# EAGLE design suzie_bot (EAGLE 7.6.0)
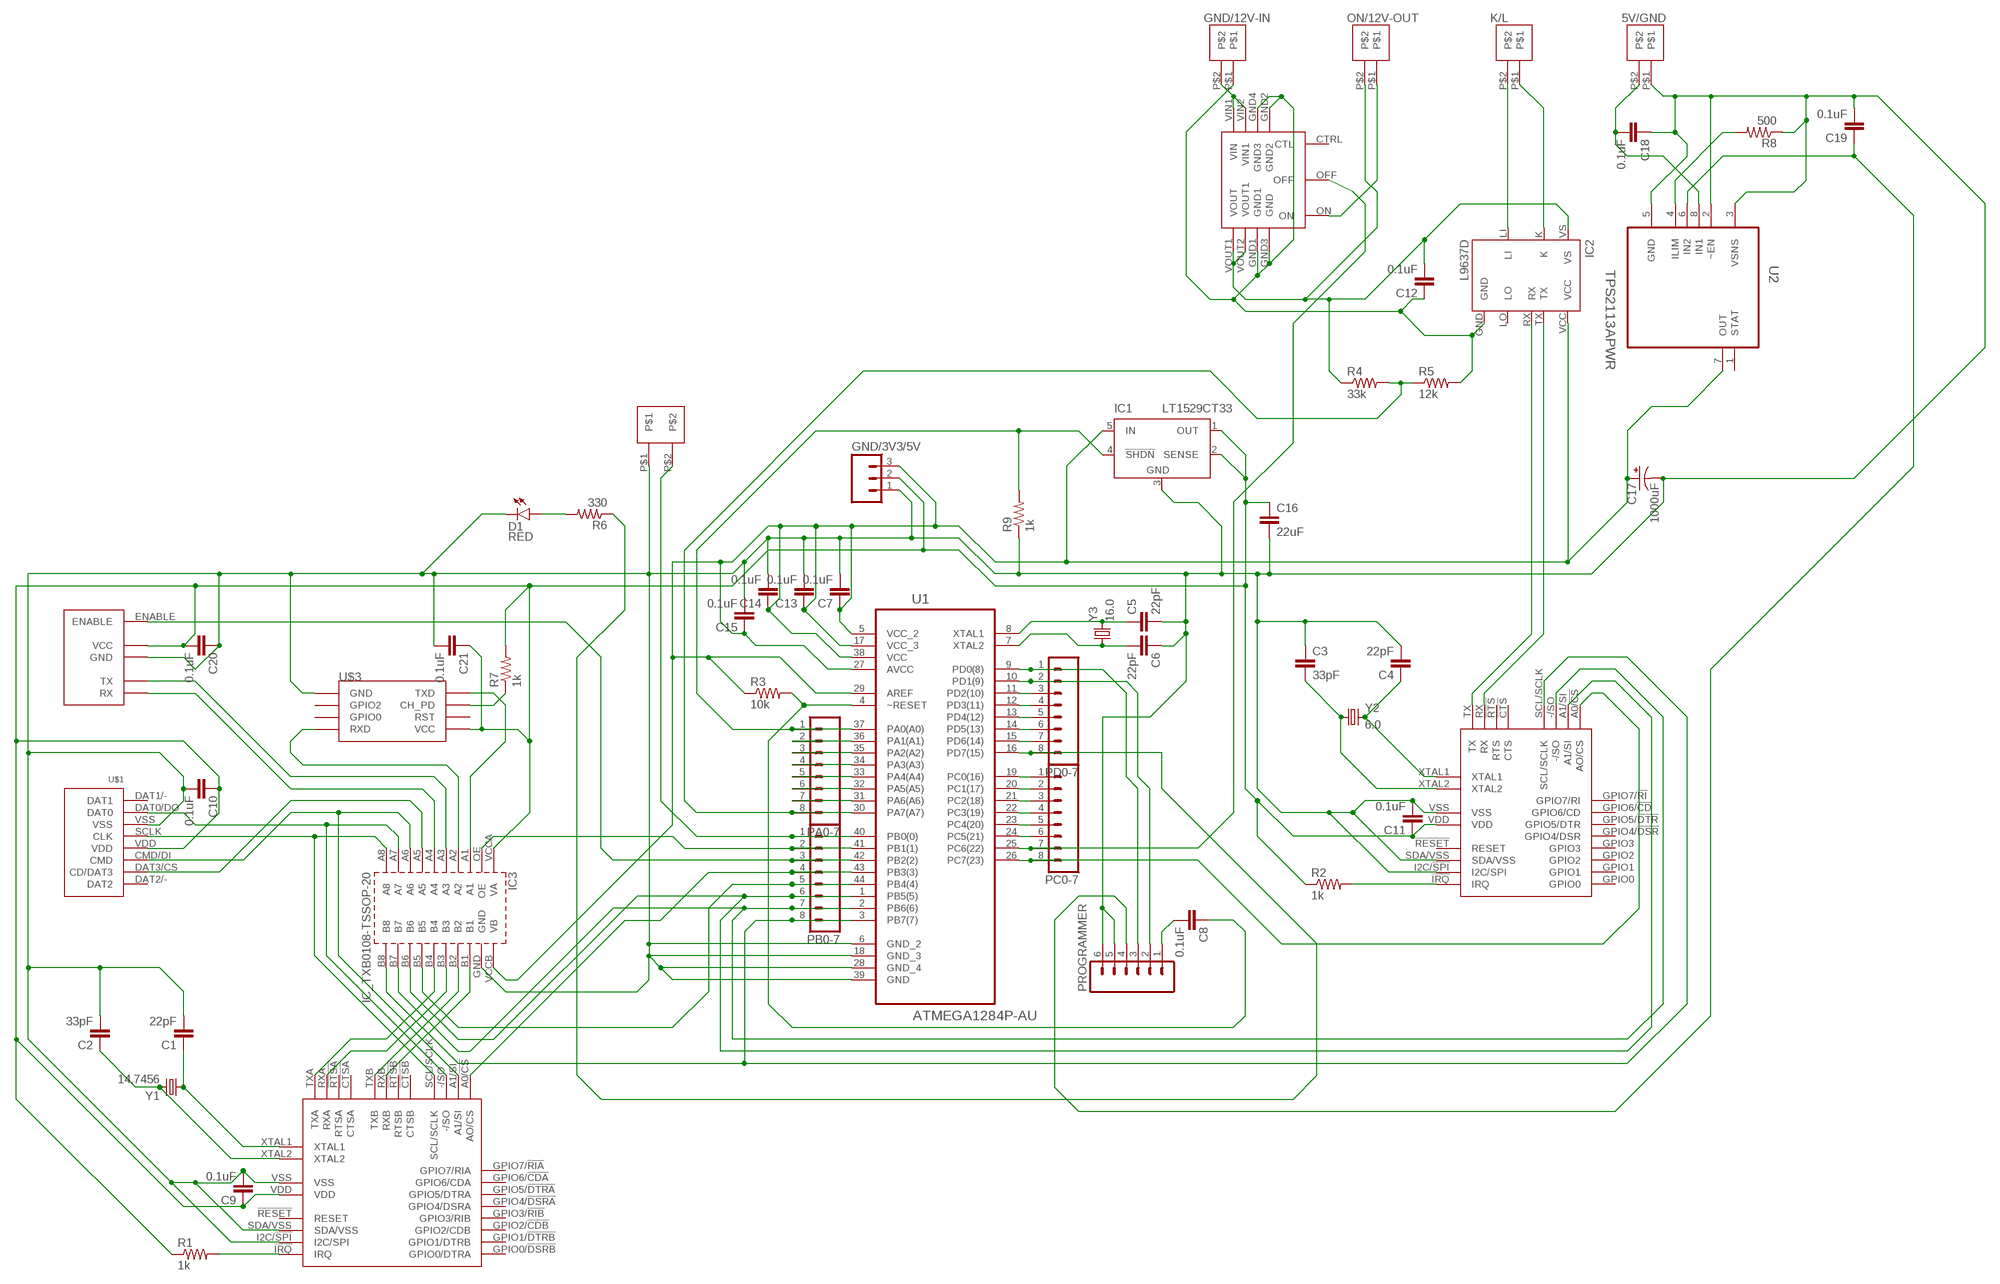
[diagram p0: schematic, sheet 1]

## Parts
5V/GND  2-PIN-TERMINAL  [2-PIN-TERMINAL]
C1  22pF  CAP0805  [0805]
C2  33pF  CAP0805  [0805]
C3  33pF  CAP0805  [0805]
C4  22pF  CAP0805  [0805]
C5  22pF  CAP0805  [0805]
C6  22pF  CAP0805  [0805]
C7  0.1uF  CAP0603-CAP  [0603-CAP]
C8  0.1uF  CAP0805  [0805]
C9  0.1uF  CAP0603-CAP  [0603-CAP]
C10  0.1uF  CAP0603-CAP  [0603-CAP]
C11  0.1uF  CAP0603-CAP  [0603-CAP]
C12  0.1uF  CAP0603-CAP  [0603-CAP]
C13  0.1uF  CAP0603-CAP  [0603-CAP]
C14  0.1uF  CAP0603-CAP  [0603-CAP]
C15  0.1uF  CAP0603-CAP  [0603-CAP]
C16  22uF  CAP1206  [1206]
C17  1000uF  CPOL-USG  [PANASONIC_G]
C18  0.1uF  CAP0603-CAP  [0603-CAP]
C19  0.1uF  CAP0603-CAP  [0603-CAP]
C20  0.1uF  CAP0603-CAP  [0603-CAP]
C21  0.1uF  CAP0603-CAP  [0603-CAP]
D1  RED  LED5MM  [LED5MM]
GND/3V3/5V  M03PTH  [1X03]
GND/12V-IN  2-PIN-TERMINAL  [2-PIN-TERMINAL]
IC1  LT1529CT33  LT1529T  [TO220-5]
IC2  L9637D  [SO08]
IC3  IC_TXB0108-TSSOP-20  [TSSOP-20]
K/L  2-PIN-TERMINAL  [2-PIN-TERMINAL]
ON/12V-OUT  2-PIN-TERMINAL  [2-PIN-TERMINAL]
PA0-7  M08  [1X08_ROUND]
PB0-7  M08  [1X08_ROUND]
PC0-7  M08  [1X08_ROUND]
PD0-7  M08  [1X08_ROUND]
PROGRAMMER  M06SILK_FEMALE_PTH  [1X06]
R1  1k  RESISTOR0805-RES  [0805]
R2  1k  RESISTOR0805-RES  [0805]
R3  10k  RESISTOR0805-RES  [0805]
R4  33k  RESISTOR0805-RES  [0805]
R5  12k  RESISTOR0805-RES  [0805]
R6  330  RESISTOR0805-RES  [0805]
R7  1k  RESISTOR0805-RES  [0805]
R8  500  RESISTOR0805-RES  [0805]
R9  1k  RESISTOR0805-RES  [0805]
U1  ATMEGA1284P-AU  [QFP80P1200X1200X120-44N]
U2  TPS2113APWR  [SOP65P640X120-8N]
U$1  CON_MICROSDHINGED  [CON_MICROSD_HINGED]
U$2  SC16IS752IPW  [TSSOP28]
U$3  ESP01  [ESP01]
U$4  MINI  [MINI]
U$5  FEATHERWING  [FEATHERWING]
U$7  SC16IS750IPW  [TSSOP-24]
U$11  PIEZO  [17MM-PIEZO]
Y1  14.7456  CRYSTALHC49US  [HC49US]
Y2  6.0  CRYSTALHC49US  [HC49US]
Y3  16.0  CRYSTALHC49US  [HC49US]

## Nets
3V3 [power]: C9.1 C10.1 C11.1 C16.1 C20.2 C21.1 GND/3V3/5V.2 IC1.1(OUT) IC1.2(SENSE) IC3.VCCA(VA) R1.1 R2.1 R7.2 U$1.VDD U$2.VDD U$3.VCC U$5.VCC U$7.VDD
5V [power]: C7.1 C13.1 C14.1 C15.1 C17.+ GND/3V3/5V.3 IC1.5(IN) IC2.VCC IC3.VCCB(VB) R3.1 U1.5(VCC_2) U1.17(VCC_3) U1.27(AVCC) U1.29(AREF) U1.38(VCC) U2.7(OUT)
12V-OUT [power]: C12.2 IC2.VS ON/12V-OUT.P$2 R4.1 U$4.VOUT1(VOUT) U$4.VOUT2(VOUT1)
EXTGND [power]: C12.1 GND/12V-IN.P$1 IC2.GND R5.2 U$4.GND1 U$4.GND2 U$4.GND3(GND) U$4.GND4(GND3)
GND [power]: 5V/GND.P$1 C1.2 C2.2 C3.1 C4.2 C5.2 C6.1 C7.2 C9.2 C10.2 C11.2 C13.2 C14.2 C15.2 C16.2 C17.- C18.1 C19.2 C20.1 C21.2 D1.K(C) GND/3V3/5V.1 IC1.3(GND) IC3.GND PROGRAMMER.5 PROGRAMMER.6 R8.1 R9.1 U1.6(GND_2) U1.18(GND_3) U1.28(GND_4) U1.39(GND) U2.2(~EN) U2.3(VSNS) U2.5(GND) U$1.VSS U$2.I2C/!SPI(I2C/SPI) U$2.SDA/VSS U$2.VSS U$3.GND U$5.GND U$7.I2C/!SPI(I2C/SPI) U$7.SDA/VSS U$7.VSS U$11.P$1
K [power]: IC2.K K/L.P$1
L [power]: IC2.LI K/L.P$2
MISO3V3: IC3.A7 U$1.DAT0/DO(DAT0) U$2.-/SO
MOSI3V3: IC3.A6 U$1.CMD/DI(CMD) U$2.A1/SI
N$1: C1.1 U$2.XTAL1 Y1.1
N$2: D1.A R6.2
N$3: C2.1 U$2.XTAL2 Y1.2
N$4: R7.1 U$3.CH_PD
N$5: IC3.A1 U$3.TX(TXD)
N$6: C6.2 U1.7(XTAL2) Y3.1
N$7: GND/12V-IN.P$2 U$4.VIN1(VIN) U$4.VIN2(VIN1)
N$8: IC3.A2 U$3.RX(RXD)
N$9: C5.1 U1.8(XTAL1) Y3.2
N$10: C8.2 PROGRAMMER.1
N$11: IC3.B1 U$2.RXB
N$12: IC3.B2 U$2.TXB
N$13: C8.1 R3.2 U1.4(~RESET)
N$14: IC3.A4 U$5.RX-2(RX)
N$15: IC2.RX U$7.TX
N$16: R2.2 U$7.!IRQ(IRQ)
N$17: IC3.B3 U$2.RXA
N$18: R1.2 U$2.!IRQ(IRQ)
N$19: IC2.TX U$7.RX
N$20: C4.1 U$7.XTAL1 Y2.2
N$21: C3.2 U$7.XTAL2 Y2.1
N$22: IC3.A3 U$5.TX-2(TX)
N$23: IC3.B4 U$2.TXA
N$24: IC3.A5 U$1.DAT3/CS(CD/DAT3)
N$25: IC3.OE PB0-7.2 U1.41(PB1(1))
N$26: IC3.B5 PB0-7.5 U1.44(PB4(4))
N$27: PA0-7.7 U1.31(PA6(A6))
N$28: PA0-7.6 U1.32(PA5(A5))
N$30: C19.1 PROGRAMMER.4 U2.6(IN2)
N$31: R8.2 U2.4(ILIM)
N$32: 5V/GND.P$2 C18.2 U2.8(IN1)
N$PD0/RXD0: PD0-7.1 PROGRAMMER.3 U1.9(PD0(8))
PA0: IC1.4(!SHDN) PA0-7.1 R9.2 U1.37(PA0(A0))
PA1: PA0-7.2 U1.36(PA1(A1))
PA2: PA0-7.3 U1.35(PA2(A2))
PA3: PA0-7.4 U1.34(PA3(A3))
PA4: PA0-7.5 U1.33(PA4(A4))
PA7: PA0-7.8 R4.2 R5.1 U1.30(PA7(A7))
PB0: PB0-7.1 U1.40(PB0(0)) U$11.P$2
PB2: PB0-7.3 U1.42(PB2(2)) U$5.ENABLE
PB3: PB0-7.4 U1.43(PB3(3)) U$2.A0/!CS(AO/CS)
PB5/MOSI: IC3.B6 PB0-7.6 U1.1(PB5(5)) U$7.A1/SI
PB6/MISO: IC3.B7 PB0-7.7 U1.2(PB6(6)) U$7.-/SO
PB7/SCLK: IC3.B8 PB0-7.8 U1.3(PB7(7)) U$7.SCL/SCLK
PC0: PC0-7.1 U1.19(PC0(16))
PC1: PC0-7.2 U1.20(PC1(17))
PC2: PC0-7.3 U1.21(PC2(18))
PC3: PC0-7.4 U1.22(PC3(19))
PC4: PC0-7.5 U1.23(PC4(20))
PC5: PC0-7.6 U1.24(PC5(21))
PC6: PC0-7.7 U1.25(PC6(22)) U$4.OFF
PC7: PC0-7.8 U1.26(PC7(23)) U$7.A0/!CS(AO/CS)
PD1/TXD0: PD0-7.2 PROGRAMMER.2 U1.10(PD1(9))
PD2/RXD1: PD0-7.3 U1.11(PD2(10))
PD3/TXD1: PD0-7.4 U1.12(PD3(11))
PD4: PD0-7.5 U1.13(PD4(12))
PD5: PD0-7.6 U1.14(PD5(13))
PD6: PD0-7.7 U1.15(PD6(14))
PD7: PD0-7.8 R6.1 U1.16(PD7(15))
POWERON [power]: ON/12V-OUT.P$1 U$4.ON
SKCK3V3: IC3.A8 U$1.SCLK(CLK) U$2.SCL/SCLK
Unconnected: IC2.LO U2.1(STAT) U$1.DAT1/-(DAT1) U$1.DAT2/-(DAT2) U$2.!CTSA(CTSA) U$2.!CTSB(CTSB) U$2.!RESET(RESET) U$2.!RTSA(RTSA) U$2.!RTSB(RTSB) U$2.GPIO0/!DSRB(GPIO0/DTRA) U$2.GPIO1/!DTRB(GPIO1/DTRB) U$2.GPIO2/!CDB(GPIO2/CDB) U$2.GPIO3/!RIB(GPIO3/RIB) U$2.GPIO4/!DSRA(GPIO4/DSRA) U$2.GPIO5/!DTRA(GPIO5/DTRA) U$2.GPIO6/!CDA(GPIO6/CDA) U$2.GPIO7/!RIA(GPIO7/RIA) U$3.GPIO0 U$3.GPIO2 U$3.RST U$4.CTRL(CTL) U$7.!CTS(CTS) U$7.!RESET(RESET) U$7.!RTS(RTS) U$7.GPIO0 U$7.GPIO1 U$7.GPIO2 U$7.GPIO3 U$7.GPIO4/!DSR(GPIO4/DSR) U$7.GPIO5/!DTR(GPIO5/DTR) U$7.GPIO6/!CD(GPIO6/CD) U$7.GPIO7/!RI(GPIO7/RI)

## Library data of the parts
5V/GND GND/12V-IN K/L ON/12V-OUT = randomjunk:2-PIN-TERMINAL
C1-C6 C8 = SparkFun-Passives:CAP: Capacitor Standard 0603 ceramic capacitor, and 0.1" leaded capacitor.
C7 C9-C16 C18-C21 = SparkFun-Capacitors:CAP: Capacitor Standard 0603 ceramic capacitor, and 0.1" leaded capacitor.
C17 = rcl:CPOL-US: POLARIZED CAPACITOR, American symbol
D1 = SparkFun-LED:LED: LEDs Standard schematic elements and footprints for 5mm, 3mm, 1206, and 0603 sized LEDs. 5mm - Spark Fun Electronics SKU : COM-00529 (and others)
GND/3V3/5V = SparkFun-Connectors:M03: Header 3 Standard 3-pin 0.1" header. Use with straight break away headers (SKU : PRT-00116), right angle break away headers (PRT-00553), swiss pins (PRT-00743), machine pins (PRT-00117), and female headers (PRT-00115). Molex polarized connector foot print use with SKU : PRT-08232 with associated crimp pins and housings.
IC1 = ltc1440_lt1529_ds1302:LT1529: LT1529 5 Volt LDO Regulator 5 Volt, 3 Ampere Low Dropout voltage regulator.
IC2 = st-microelectronics:L9637D: ISO 9141 INTERFACE Source: 1765.pdf
IC3 = dp_devices.v6:IC_TXB0108: 8-Bit bidirectional voltage level translator Mfr no: TXB0108PWR TXB0108PWR <http://www.digikey.com/product-detail/en/TXB0108PWR/296-21527-2-ND/1305699>
PA0-7 PB0-7 PC0-7 PD0-7 = SparkFun-Connectors:M08: Header 8 Standard 8-pin 0.1" header. Use with straight break away headers (SKU : PRT-00116), right angle break away headers (PRT-00553), swiss pins (PRT-00743), machine pins (PRT-00117), and female headers (PRT-00115).; PROD_ID: CONN-08437
PROGRAMMER = SparkFun-Connectors:M06: Header 6 Standard 6-pin 0.1" header. Use with straight break away headers (SKU : PRT-00116), right angle break away headers (PRT-00553), swiss pins (PRT-00743), machine pins (PRT-00117), and female headers (PRT-00115). Molex polarized connector foot print use with SKU : PRT-08094 with associated crimp pins and housings. NOTES ON THE VARIANTS LOCK and LOCK_LONGPADS... This footprint was designed to help hold the alignment of a through-hole component (i.e. 6-pin header) while soldering it into place. You may notice that each hole has been shifted either up or down by 0.005 of an inch from it's more standard position (which is a perfectly straight line). This slight alteration caused the pins (the squares in the middle) to touch the edges of the holes. Because they are alternating, it causes a "brace" to hold the component in place. 0.005 has proven to be the perfect amount of "off-center" position when using our standard breakaway headers. Although looks a little odd when you look at the bare footprint, once you have a header in there, the alteration is very hard to notice. Also,if you push a header all the way into place, it is covered up entirely on the bottom side. This idea of altering the position of holes to aid alignment will be further integrated into the Sparkfun Library for other footprints. It can help hold any component with 3 or more connection pins.; PROD_ID: CONN-08437
R1-R9 = SparkFun-Passives:RESISTOR: Resistor Basic schematic elements and footprints for 0603, 1206, and PTH resistors.
U1 = Atmel_By_element14_Batch_1-00:ATMEGA1284P-AU: Microcontroller with Programmable Flash; MPN: ATMEGA1284P-AU; OC_FARNELL: 1715480; OC_NEWARK: 15R0263; PACKAGE: TQFP-44; SUPPLIER: Atmel
U2 = Texas Instruments_By_element14_Batch_1:TPS2113APWR: AUTOSWITCHING POWER MUX; MPN: TPS2113APWR; OC_FARNELL: 1757288; OC_NEWARK: 01J0961; PACKAGE: TSSOP-8; SUPPLIER: TEXAS INSTRUMENTS
U$1 = dp_devices.v6:CON_MICROSD
U$2 = nxp-semiconductors:SC16IS752IPW
U$3 = esp8266modules:ESP01: ESP8266 Wifi module 01
U$4 = pololu:MINI
U$5 = featherwing:FEATHERWING
U$7 = nxp-semiconductors:SC16IS750IPW
U$11 = tdk:PIEZO
Y1-Y3 = SparkFun-FreqCtrl:CRYSTAL: Various standard crystals. Proven footprints.

## Net classes
0 default: width 0.152 mm, drill 0.152 mm, clearance 0.152 mm
1 power: width 0.305 mm, drill 0.305 mm, clearance 0.152 mm to class 0, clearance 0.152 mm

## Board
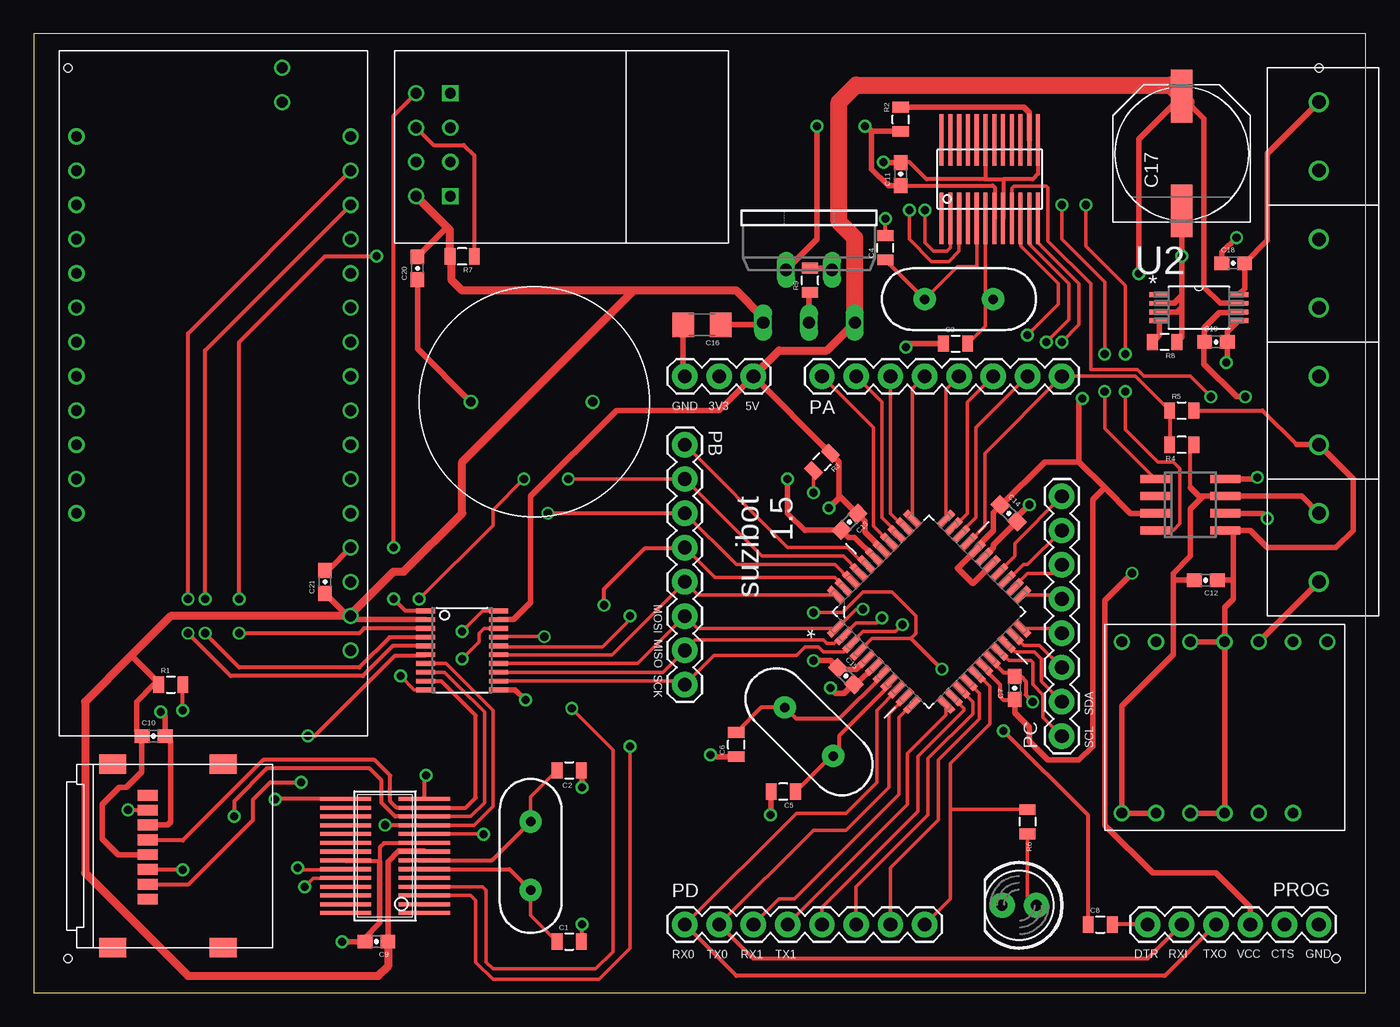
[diagram p1: board, top side]
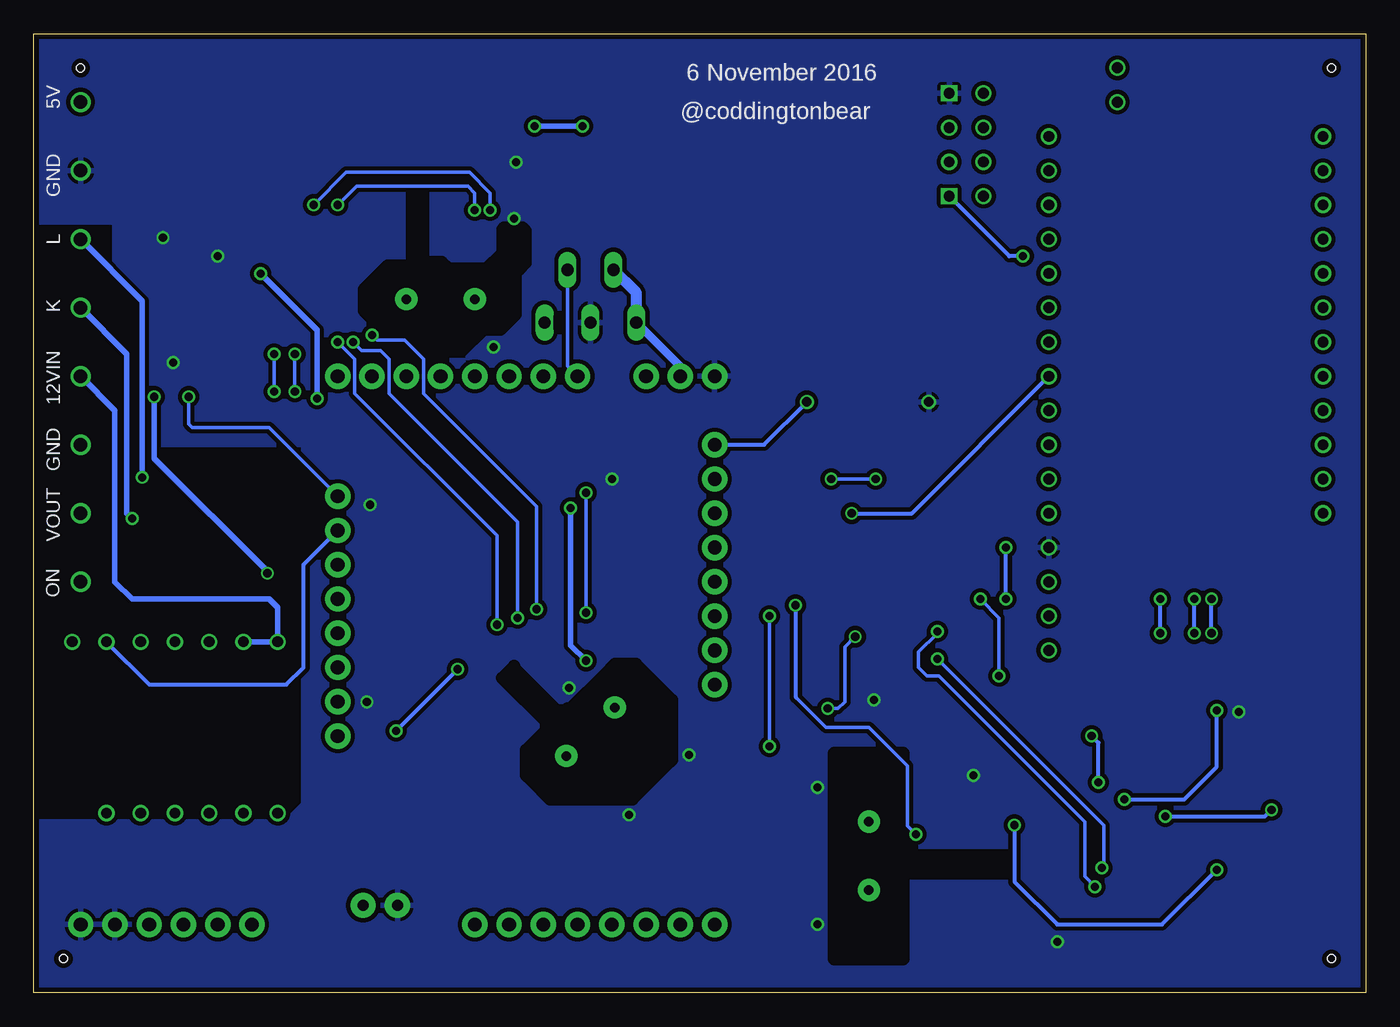
[diagram p2: board, bottom side, seen from below]

Size 98.73 x 71.11 mm. Coordinates in mm from the lower left corner, seen from the top.
Outline: 0,0 98.73,0 98.73,71.11 0,71.11 0,0
Copper layers (1*16): Top 0.0356mm / dielectric 1.5011mm / Bottom 0.0356mm
Design rules "oshpark-2layer": minimum track width 6mil, minimum drill 13mil, track to track 6mil, track to pad 6mil, pad to pad 6mil, via to via 6mil, smd to smd 6mil, copper to edge 15mil, drill to drill 6mil, minimum pad ring 7mil, minimum via ring 7mil, stop-mask expansion 2.5mil, vias tented up to drill 0mil, thermal gap 10mil
Holes 0.6 mm at 2.54,68.58 2.54,2.54 96.52,2.54 95.25,68.58
bRestrict: area 26.7,2.5 to 39.4,17.8; area 51.4,14.4 to 64,24.4; area 62.2,47.5 to 74.3,59.3

### Footprints (pad centres in the part's own frame; a part is rotated, then mirrored left to right if it is on the bottom)
2-PIN-TERMINAL = drill 1: P$1 2.54,0; P$2 -2.54,0
0805 = smd 0.8 x 1.2: 1 -0.9,0; 2 0.9,0
0603-CAP = smd 1.1 x 1: 1 -0.85,0; 2 0.85,0
1206 = smd 1.6 x 1.8: 1 -1.4,0; 2 1.4,0
PANASONIC_G = smd 3.9 x 1.6: + 4.25,0; - -4.25,0
LED5MM = drill 0.813 pad 1.88: A -1.27,0; K 1.27,0
1X03 = drill 1.016 pad 1.88: 1 0,0; 2 2.54,0; 3 5.08,0
TO220-5 = drill 0.9 long: 1 -3.4,-8.4; 2 -1.7,-4.5; 3 0,-8.4; 4 1.7,-4.5; 5 3.4,-8.4
SO08 = smd 0.6 x 2.2: GND 1.905,2.6; K 0.635,2.6; LI -1.905,2.6; LO -0.635,-2.6; RX -1.905,-2.6; TX 1.905,-2.6; VCC 0.635,-2.6; VS -0.635,2.6
TSSOP-20 = smd 0.35 x 1.43: A1 -2.925,-2.7; A2 -1.625,-2.7; A3 -0.975,-2.7; A4 -0.325,-2.7; A5 0.325,-2.7; A6 0.975,-2.7; A7 1.625,-2.7; A8 2.275,-2.7; B1 -2.925,2.7; B2 -1.625,2.7; B3 -0.975,2.7; B4 -0.325,2.7; B5 0.325,2.7; B6 0.975,2.7; B7 1.625,2.7; B8 2.275,2.7; GND 2.925,2.7; OE 2.925,-2.7; VCCA -2.275,-2.7; VCCB -2.275,2.7
1X08_ROUND = drill 1.016 pad 1.88: 1 0,0; 2 2.54,0; 3 5.08,0; 4 7.62,0; 5 10.16,0; 6 12.7,0; 7 15.24,0; 8 17.78,0
1X06 = drill 1.016 pad 1.88: 1 0,0; 2 2.54,0; 3 5.08,0; 4 7.62,0; 5 10.16,0; 6 12.7,0
QFP80P1200X1200X120-44N = smd 1.473 x 0.508: 1 -5.74,3.988; 2 -5.74,3.2; 3 -5.74,2.388; 4 -5.74,1.6; 5 -5.74,0.787; 6 -5.74,0; 7 -5.74,-0.787; 8 -5.74,-1.6; 9 -5.74,-2.388; 10 -5.74,-3.2; 11 -5.74,-3.988; 23 5.74,-3.988; 24 5.74,-3.2; 25 5.74,-2.388; 26 5.74,-1.6; 27 5.74,-0.787; 28 5.74,0; 29 5.74,0.787; 30 5.74,1.6; 31 5.74,2.388; 32 5.74,3.2; 33 5.74,3.988 | smd 0.508 x 1.473: 12 -3.988,-5.74; 13 -3.2,-5.74; 14 -2.388,-5.74; 15 -1.6,-5.74; 16 -0.787,-5.74; 17 0,-5.74; 18 0.787,-5.74; 19 1.6,-5.74; 20 2.388,-5.74; 21 3.2,-5.74; 22 3.988,-5.74; 34 3.988,5.74; 35 3.2,5.74; 36 2.388,5.74; 37 1.6,5.74; 38 0.787,5.74; 39 0,5.74; 40 -0.787,5.74; 41 -1.6,5.74; 42 -2.388,5.74; 43 -3.2,5.74; 44 -3.988,5.74
SOP65P640X120-8N = smd 1.473 x 0.356: 1 -2.921,0.965; 2 -2.921,0.33; 3 -2.921,-0.33; 4 -2.921,-0.965; 5 2.921,-0.965; 6 2.921,-0.33; 7 2.921,0.33; 8 2.921,0.965
CON_MICROSD_HINGED = smd 1.45 x 2: BODY@1 -6.8,5.2; BODY@2 -6.8,-3; BODY@3 6.8,-3; BODY@4 6.8,5.2 | smd 0.8 x 1.5: CMD/DI -1,2.6; DAT0/DO 3.4,2.6; DAT1/- 4.5,2.6; DAT2/- -3.2,2.6; DAT3/CS -2.1,2.6; SCLK 1.2,2.6; VDD 0.1,2.6; VSS 2.3,2.6
TSSOP28 = smd 0.305 x 3.81: !CTSA -3.575,-2.918; !CTSB 3.575,2.918; !IRQ 4.225,2.918; !RESET -1.625,-2.918; !RTSA -4.225,-2.918; !RTSB 2.925,2.918; -/SO 2.925,-2.918; A0/!CS 1.625,-2.918; A1/SI 2.275,-2.918; GPIO0/!DSRB 2.275,2.918; GPIO1/!DTRB 1.625,2.918; GPIO2/!CDB 0.975,2.918; GPIO3/!RIB 0.325,2.918; GPIO4/!DSRA -2.275,2.918; GPIO5/!DTRA -2.925,2.918; GPIO6/!CDA -3.575,2.918; GPIO7/!RIA -4.225,2.918; I2C/!SPI 0.975,-2.918; RXA -2.275,-2.918; RXB -1.625,2.918; SCL/SCLK 3.575,-2.918; SDA/VSS 4.225,-2.918; TXA -2.925,-2.918; TXB -0.975,2.918; VDD 0.325,-2.918; VSS -0.325,2.918; XTAL1 -0.975,-2.918; XTAL2 -0.325,-2.918
ESP01 = drill 0.8: CH_PD -1.285,-8.178; GPIO0 1.255,-5.638; GPIO2 -1.285,-5.638; RST 1.255,-8.178; TX -3.825,-8.178; VCC 3.795,-8.178 | drill 0.8 square: GND -3.825,-5.638; RX 3.795,-5.638
MINI = drill 0.8: BUTTON1 -7.62,-2.54; BUTTON2 -7.62,-5.08; CTRL 5.08,-7.62; GND1 -7.62,2.54; GND2 -7.62,0; GND3 5.08,2.54; GND4 5.08,0; OFF 5.08,-5.08; ON 5.08,-2.54; VIN1 5.08,7.62; VIN2 5.08,5.08; VOUT1 -7.62,7.62; VOUT2 -7.62,5.08
FEATHERWING = drill 0.8: ENABLE 1.27,-10.16; GND -11.43,-10.16; P$2 -13.97,-10.16; P$6 19.05,10.16; P$7 16.51,10.16; P$8 13.97,10.16; P$9 11.43,10.16; P$10 8.89,10.16; P$11 6.35,10.16; P$12 3.81,10.16; P$13 1.27,10.16; P$14 -1.27,10.16; P$15 -3.81,10.16; P$16 -6.35,10.16; P$17 -8.89,10.16; P$19 -8.89,-10.16; P$20 -6.35,-10.16; P$21 -3.81,-10.16; P$22 -1.27,-10.16; P$24 3.81,-10.16; P$25 6.35,-10.16; P$26 8.89,-10.16; P$27 11.43,-10.16; P$30 19.05,-10.16; RST -19.05,-10.16; RX 24.13,-5.08; RX-2 16.51,-10.16; TX 21.59,-5.08; TX-2 13.97,-10.16; VCC -16.51,-10.16
TSSOP-24 = smd 0.305 x 3.81: !CTS -3.575,-2.918; !IRQ 2.925,2.918; !RESET -1.625,-2.918; !RTS -3.575,2.918; -/SO 2.925,-2.918; A0/!CS 1.625,-2.918; A1/SI 2.275,-2.918; GPIO0 2.275,2.918; GPIO1 1.625,2.918; GPIO2 0.975,2.918; GPIO3 0.325,2.918; GPIO4/!DSR -0.975,2.918; GPIO5/!DTR -1.625,2.918; GPIO6/!CD -2.275,2.918; GPIO7/!RI -2.925,2.918; I2C/!SPI 0.975,-2.918; RX -2.275,-2.918; SCL/SCLK 3.575,-2.918; SDA/VSS 3.575,2.918; TX -2.925,-2.918; VDD 0.325,-2.918; VSS -0.325,2.918; XTAL1 -0.975,-2.918; XTAL2 -0.325,-2.918
17MM-PIEZO = drill 0.7: P$1 -5.705,0; P$2 3.324,0
HC49US = drill 0.7 pad 1.651: 1 -2.54,0; 2 2.54,0

### Placement (x,y rotation side)
5V/GND  95.25,63.5 270 top
C1  39.69,3.81 0 top
C2  39.69,16.51 0 top
C3  68.33,48.13 0 top
C4  63.12,55.24 90 top
C5  55.56,14.92 180 top
C6  52.07,18.41 90 top
C7  72.71,22.61 90 top
C8  79.06,5.08 0 top
C9  25.4,3.81 180 top
C10  8.89,19.05 0 top
C11  64.26,60.71 90 top
C12  86.87,30.61 180 top
C13  60.45,34.92 225 top
C14  72.26,35.56 315 top
C15  60.2,23.5 315 top
C16  49.53,49.53 180 top
C17  85.09,62.23 90 top
C18  88.9,54.1 0 top
C19  87.63,48.26 0 top
C20  28.45,53.72 90 top
C21  21.59,30.48 90 top
D1  73.05,6.5 180 top
GND/3V3/5V  48.26,45.72 0 top
GND/12V-IN  95.25,43.18 270 top
IC1  57.47,58.1 0 top
IC2  85.72,36.2 270 top
IC3  31.75,25.4 270 top
K/L  95.25,53.34 270 top
ON/12V-OUT  95.25,33.02 270 top
PA0-7  58.42,45.72 0 top
PB0-7  48.26,40.64 270 top
PC0-7  76.2,19.05 90 top
PD0-7  48.26,5.08 0 top
PROGRAMMER  82.55,5.08 0 top
R1  10.16,22.86 0 top
R2  64.26,64.77 90 top
R3  58.42,39.37 225 top
R4  85.09,40.64 180 top
R5  85.09,43.18 0 top
R6  73.66,12.7 270 top
R7  31.75,54.61 180 top
R8  83.82,48.26 180 top
R9  57.53,52.83 90 top
U1  66.36,28.26 45 top
U2  86.36,50.8 0 top
U$1  11.05,10.16 90 top
U$2  26.04,10.16 90 top
U$3  36.51,62.87 270 top
U$4  88.27,20.95 90 top
U$5  13.34,44.45 90 top
U$7  70.87,60.33 0 top
U$11  38.1,43.81 0 top
Y1  36.83,10.16 90 top
Y2  68.58,51.44 180 top
Y3  57.47,19.37 315 top

### Tracks (layer width: path | path; a pad name or v marks a point on that pad's centre or on a via)
3V3  (via drill 0.6)
  Top 0.305: C11.1 71.08,59.86 71.25,59.69 71.25,57.46 U$7.VDD
  Top 0.406: C16.1 53.9,49.53 IC1.1 | R7.2 30.85,54.24 | U$5.VCC 23.75,27.94 24,27.69 29.04,27.69 IC3.VCCA | C9.1 26.25,9.74 27.05,10.54 28.9,10.54 U$2.VDD | 7.24,25.02 9.26,23 R1.1 8.89,22.86 7.62,21.59 7.62,19.47 C10.1 8,19.01 8,16.38 6.86,15.24 6.35,15.24 5.08,13.97 5.08,11.43 6.25,10.26 U$1.VDD | v58.04,64.26 58.04,55.87 IC1.2 | v61.59,64.26 61.72,64.26 62.1,63.88 | 62.1,63.88 64.25,63.88 R2.1 | C11.1 63.33,59.86 62.1,61.09 62.1,63.88 | 30.85,56.55 30.43,56.55 C20.2 | 23.5,28.07 23.15,28.07 C21.1
  Top 0.61: C9.1 26.29,3.77 26.29,2.03 25.53,1.27 11.43,1.27 3.81,8.89 3.81,21.59 7.24,25.02 10.16,27.94 U$5.VCC 23.5,28.07 26.67,31.24 27.43,31.24 31.75,35.56 31.75,39.37 44.45,52.07 | IC1.1 54.07,50.07 52.07,52.07 44.45,52.07 | 44.45,52.07 31.75,52.07 30.99,52.83 30.99,54.47 R7.2 30.85,56.55 U$3.VCC
  Bottom 0.406: v58.04,64.26 v61.59,64.26
  Bottom 0.61: GND/3V3/5V.2 50.8,46.44 IC1.1
  Bottom 0.813: IC1.1 54.07,51.9 IC1.2
5V  (via drill 0.6)
  Top 0.305: U1.17 70.42,24.07 71.63,22.86 71.63,21.97 71.88,21.72 72.67,21.72 C7.1
  Top 0.406: U1.5 61.71,24.75 60.96,24 59.69,24 C15.1 59.05,24.64 v57.78,24.64 | 59.69,36.89 59.69,39.37 R3.1 GND/3V3/5V.3 50.8,43.18 43.18,43.18 36.83,36.83 36.83,28.96 35.56,27.69 34.46,27.69 IC3.VCCB | 59.69,36.89 C13.1 61.59,34.98 61.59,34.16 62.85,32.9 U1.38 | 59.69,36.89 59.69,36.7 v58.93,35.94 | U1.27 70.97,31.73 69.6,30.35 68.45,31.5 68.48,31.5 U1.29 69.86,33.03 71.12,34.29 71.12,35.62 C14.1 71.72,36.16 74.93,39.37 77.47,39.37 | 77.47,39.37 79.38,37.47 | 79.38,37.47 81.28,35.56 IC2.VCC | 77.47,39.37 77.47,43.81 v77.72,44.07 | v81.92,53.34 81.92,63.3 C17.+ 86.74,64.83 86.74,52.32 87.94,51.13 U2.7 | C7.1 72.71,20.77 73.79,19.68 73.79,18.67 75.18,17.27 77.47,17.27 78.49,18.29 78.49,36.58 79.38,37.47
  Top 0.61: GND/3V3/5V.3 55.24,47.62 58.79,47.62 IC1.5
  Top 1.016: 85.53,66.04 C17.+
  Top 1.27: IC1.5 60.87,55.97 59.69,57.15 59.69,66.04 60.96,67.31 84.26,67.31 C17.+
  Bottom 0.406: v58.93,35.94 58.93,25.78 v57.78,24.64 | v77.72,44.07 77.72,49.15 v81.92,53.34
12V-OUT
  Top 0.305: 85.72,37.47 85.72,40.38 R4.1
  Top 0.406: ON/12V-OUT.P$2 93.98,36.83 IC2.VS 86.68,36.83 | 84.45,30.48 84.45,25.08 80.64,21.27 U$4.VOUT1 U$4.VOUT2 | 84.45,30.48 84.45,31.11 85.72,32.38 85.72,35.88 86.68,36.83 | 86.68,36.83 86.36,36.83 85.72,37.47 | C12.2 84.58,30.61 84.45,30.48
EXTGND
  Top 0.305: R5.2 91.07,43.18 93.61,40.64
  Top 0.406: 93.61,40.64 GND/12V-IN.P$1 97.79,38.1 97.79,34.29 96.52,33.02 91.44,33.02 90.17,34.29 88.9,34.29 | IC2.GND 88.9,34.29 | 88.9,30.48 88.9,29.21 88.27,28.57 U$4.GND4 | 88.9,30.48 88.9,34.29 | U$4.GND4 U$4.GND2 U$4.GND1 | U$4.GND3 U$4.GND4 | C12.1 88.77,30.61 88.9,30.48
GND  (via drill 0.6)
  Top 0.305: 28.95,11.14 U$2.I2C/!SPI 28.92,11.1 25.96,11.1 25.65,10.79 25.65,9.78 23.17,9.78 U$2.VSS | C1.2 40.64,3.81 v40.64,5.08 | U$2.SDA/VSS 28.95,16 v29.08,16.13 | U$7.VSS 70.54,60.38 70.48,60.33 | 70.48,60.33 66.17,60.33 64.9,61.59 64.3,61.59 C11.2 | 70.48,60.33 71.88,60.33 | 71.88,60.33 71.88,57.45 U$7.I2C/!SPI | U$7.SDA/VSS 74.44,60.73 74.04,60.33 71.88,60.33 | C4.2 v63.12,57.4 | U1.18 70.97,24.66 71.88,23.75 72.42,23.75 C7.2 73.19,23.46 73.53,23.11 73.53,22.1 v74.04,21.59
  Top 0.406: v40.64,15.24 40.64,16.46 C2.2 | IC3.GND 35.69,22.48 v36.45,21.72 | C16.2 48.13,45.85 GND/3V3/5V.1 | U$1.VSS 9.92,12.46 10.16,12.7 10.16,18.63 C10.2 9.74,20.49 v9.4,20.83 | v22.86,3.81 C9.2 24.55,4.1 25.65,5.21 25.65,9.78 | U1.39 | U1.39 60.83,33.78 60.39,33.78 C13.2 57.18,34.32 57.15,34.29 55.88,35.56 v55.88,38.1 | v59.05,22.61 59.44,22.23 60.07,22.23 60.74,22.89 C15.2 60.99,22.89 U1.6 | U1.28 71.12,33.02 71.12,33.22 C14.2 72.86,35.27 v73.79,36.2 | C6.1 50.3,17.52 v50.16,17.65 | C5.2 54.66,13.26 v54.61,13.21 | C11.2 63.03,61.56 v62.99,61.59 | C17.- v85.09,54.61 85.09,51.69 | U2.2 84.53,51.13 85.09,51.69 | U2.3 84.76,50.47 85.09,50.8 | 85.09,50.8 85.09,51.69 | U2.5 88.48,49.03 C19.2 88.48,46.82 v88.39,46.74 | C18.1 88.05,54.9 v89.15,56.01 | C3.1 64.9,48.13 v64.64,47.88 | 85.09,50.8 85.09,48.63 R8.1 | C20.1 28.45,47.76 U$11.P$1 | C21.2 21.8,31.33 U$5.GND | R9.1 57.47,51.93 IC1.3
  pour Bottom (isolate 0.305): 0,71.12 99.06,71.12 99.06,57.15 92.71,57.15 92.71,40.64 78.74,40.64 78.74,13.97 80.01,12.7 99.06,12.7 99.06,0 0,0
K  (via drill 0.6)
  Top 0.406: v91.44,35.18 91.06,35.56 IC2.K
  Bottom 0.406: K/L.P$1 91.82,47.37 91.82,35.56 v91.44,35.18
L  (via drill 0.6)
  Top 0.406: IC2.LI 90.55,38.1 v90.68,38.23
  Bottom 0.406: v90.68,38.23 90.68,51.31 K/L.P$2
MISO3V3  (via drill 0.6)
  Top 0.254: U$2.-/SO 32.39,13.09 33.4,14.1 33.4,20.83 31.5,22.73 31.49,22.73 30.57,23.65 | 29.08,23.75 IC3.A7 29.07,23.76 30.47,23.76 30.57,23.65 | 30.57,23.65
  Top 0.305: U$2.-/SO 26.79,13.09 25.78,14.1 25.78,15.75 24.89,16.64 17.27,16.64 14.86,14.22 v14.86,13.08 | 8.48,13.59 U$1.DAT0/DO | v6.99,13.59 8.42,13.59
  Top 0.406: 8.42,13.59 U$1.DAT0/DO
  Bottom 0.305: v14.86,13.08 7.49,13.08 v6.99,13.59
MOSI3V3  (via drill 0.6)
  Top 0.254: 29.09,24.38 IC3.A6 29.06,24.43 30.55,24.43 32.89,22.1 34.04,20.95 34.04,13.84 32.63,12.44 U$2.A1/SI
  Top 0.305: U$2.A1/SI 26.05,12.44 v26.04,12.45 | v11.05,9.14 8.46,9.14 U$1.CMD/DI
  Bottom 0.305: v26.04,12.45 26.04,8.26 22.86,5.08 15.11,5.08 v11.05,9.14
N$1
  Top 0.254: Y1.1 36.83,5.77 C1.1
  Top 0.305: U$2.XTAL1 35.27,9.19 Y1.1
N$2
  Top 0.254: R6.2 73.66,7.16 D1.A
N$3
  Top 0.254: Y1.2 36.83,14.55 C2.1
  Top 0.305: U$2.XTAL2 33.97,9.84 Y1.2
N$4
  Top 0.305: U$3.CH_PD 29.62,62.87 31.88,62.87 32.64,62.1 32.64,61.72 32.65,61.71 R7.1
N$5  (via drill 0.6)
  Top 0.305: IC3.A1 27.55,28.32 v26.67,29.21 | v26.67,33.02 26.67,65.03 U$3.TX
  Bottom 0.305: v26.67,29.21 v26.67,33.02
N$6
  Top 0.305: U1.7 62.85,23.48 59.69,20.32 56.52,20.32 Y3.1 53.92,21.16 C6.2
N$7
  Bottom 0.406: GND/12V-IN.P$2 92.71,43.18 92.71,30.48 91.44,29.21 81.28,29.21 80.64,28.57 U$4.VIN1 U$4.VIN2
N$8  (via drill 0.6)
  Top 0.305: IC3.A2 24.48,27.02 24.13,26.67 v15.24,26.67 | v15.24,29.21 15.24,48.26 21.59,54.61 v25.4,54.61
  Bottom 0.305: v15.24,26.67 v15.24,29.21 | v25.4,54.61 26.41,54.61 U$3.RX
N$9
  Top 0.305: U1.8 63.43,22.79 59.69,19.05 59.69,18 Y3.2 59.11,17.57 C5.1
N$10
  Top 0.305: PROGRAMMER.1 C8.2
N$11  (via drill 0.6)
  Top 0.254: IC3.B1 33.28,28.32 v31.75,26.8 | v20.07,7.87 20.7,8.51 23.09,8.51 U$2.RXB
  Bottom 0.254: v31.75,26.8 31.75,26.67 33.15,25.27 33.15,24.13 32.51,23.5 31.62,23.5 20.83,12.7 20.83,8.64 v20.07,7.87
N$12  (via drill 0.6)
  Top 0.254: IC3.B2 33.38,27.02 33.02,26.67 33.02,26.04 v31.75,24.77 | v19.56,9.27 19.68,9.14 23.08,9.14 U$2.TXB
  Bottom 0.254: v31.75,24.77 19.43,12.45 19.43,9.4 v19.56,9.27
N$13  (via drill 0.6)
  Top 0.254: 61.17,25.35 U1.4 62.13,26.29 65.02,26.29 65.41,26.67 65.41,27.94 63.63,29.72 61.47,29.72 59.94,28.19 v57.78,28.19 | v57.78,37.08 R3.2
  Top 0.305: C8.1 78.16,13.15 v71.88,19.43 | v67.31,24 65.02,26.29
  Bottom 0.254: v57.78,28.19 v57.78,37.08
  Bottom 0.305: v71.88,19.43 v67.31,24
N$14  (via drill 0.6)
  Top 0.305: IC3.A4 26.61,25.73 24.38,23.5 14.61,23.5 v11.43,26.67 | v11.43,29.21 11.43,48.9 U$5.RX-2
  Bottom 0.305: v11.43,26.67 v11.43,29.21
N$15  (via drill 0.6)
  Top 0.254: U$7.TX 67.94,55.24 67.69,54.99 66.67,54.99 66.04,55.63 v66.04,58.04 | v76.2,58.42 76.2,55.88 79.38,52.7 v79.38,47.37 | v79.38,44.58 79.38,41.85 IC2.RX
  Bottom 0.254: v66.04,58.04 66.04,59.31 66.55,59.82 74.8,59.82 v76.2,58.42 | v79.38,47.37 v79.38,44.58
N$16
  Top 0.406: U$7.!IRQ 73.79,65.27 73.41,65.66 64.27,65.66 R2.2
N$17  (via drill 0.6)
  Top 0.254: U$2.RXA 33.26,7.88 33.53,7.62 33.53,2.29 34.04,1.78 41.66,1.78 42.93,3.05 42.93,18.03 v39.88,21.08 | v37.85,26.42 34.49,26.42 IC3.B3
  Bottom 0.254: v39.88,21.08 39.12,21.08 38.61,21.59 38.61,25.65 v37.85,26.42
N$18  (via drill 0.6)
  Top 0.305: U$2.!IRQ 17.94,14.38 v17.91,14.35 | v11.05,20.95 11.05,22.85 R1.2
  Bottom 0.305: v17.91,14.35 13.46,14.35 11.05,16.76 v11.05,20.95
N$19  (via drill 0.6)
  Top 0.254: U$7.RX 68.59,55 67.82,54.23 66.55,54.23 64.9,55.88 v64.9,58.04 | v77.98,58.42 77.98,55.37 80.9,52.45 v80.9,47.37 | v80.9,44.58 80.9,41.78 83.31,39.37 84.45,39.37 84.96,38.86 84.96,34.8 84.45,34.29 IC2.TX
  Bottom 0.254: v64.9,58.04 64.9,59.31 66.42,60.83 75.56,60.83 v77.98,58.42 | v80.9,47.37 v80.9,44.58
N$20
  Top 0.254: U$7.XTAL1 69.89,53.89 69.85,53.85 68.45,53.85 Y2.2
  Top 0.305: Y2.2 66.03,51.44 C4.1
N$21
  Top 0.254: U$7.XTAL2 70.54,52.01 Y2.1 | 70.54,51.5 70.54,49.45 C3.2
  Top 0.305: 70.54,52.01 70.54,51.5
N$22  (via drill 0.6)
  Top 0.305: IC3.A3 26.38,26.38 24.13,24.13 15.24,24.13 v12.7,26.67 | v12.7,29.21 12.7,47.62 U$5.TX-2
  Bottom 0.305: v12.7,26.67 v12.7,29.21
N$23  (via drill 0.6)
  Top 0.254: U$2.TXA 32.39,7.24 32.77,6.86 32.77,2.29 34.04,1.02 41.91,1.02 44.2,3.3 v44.2,18.29 | v44.2,27.94 44.2,27.69 42.16,25.65 34.52,25.65 IC3.B4
  Bottom 0.254: v44.2,18.29 v44.2,27.94
N$24  (via drill 0.6)
  Top 0.305: U$1.DAT3/CS 11.49,8.06 16.26,12.83 16.26,14.35 17.53,15.62 v19.81,15.62 | v20.32,19.05 20.83,19.05 26.8,25.02 28.99,25.02 IC3.A5
  Bottom 0.305: v19.81,15.62 19.81,18.54 v20.32,19.05
N$25  (via drill 0.6)
  Top 0.254: U1.41 61.17,31.23 60.01,32.38 53.98,32.38 PB0-7.2 v39.62,38.1 | IC3.OE 28.2,22.48 v27.18,23.5 | v28.57,29.21 34.04,34.67 34.04,35.81 v36.32,38.1
  Bottom 0.254: v27.18,23.5 27.18,27.81 v28.57,29.21 | v36.32,38.1 v39.62,38.1
N$26
  Top 0.254: U1.44 49.24,29.5 PB0-7.5 42.85,25.07 IC3.B5
N$27
  Top 0.254: U1.31 68.73,34.12 69.85,35.24 69.85,41.91 PA0-7.7
N$28
  Top 0.254: U1.32 68.23,34.58 69.22,35.56 69.22,43.81 PA0-7.6
N$30  (via drill 0.6)
  Top 0.406: U2.6 89.23,50.42 87.88,50.42 86.78,49.31 C19.1 86.74,48.22 86.74,46.61 89.15,44.2 v89.79,44.2 | PROGRAMMER.4 90.17,6.35 87.63,8.89 82.93,8.89 79.38,12.45 79.38,29.08 v81.41,31.11
  Bottom 0.406: v81.41,31.11 81.41,31.24 89.79,39.62 v89.79,44.2
N$31
  Top 0.406: U2.4 83.44,48.78 R8.2
N$32
  Top 0.406: 5V/GND.P$2 91.44,62.23 91.44,55.79 C18.2 89.75,52.23 U2.8
N$PD0/RXD0
  Top 0.254: U1.9 63.99,22.46 62.48,20.95 62.48,15.62 60.2,13.34 56.52,13.34 PD0-7.1
  Top 0.305: PROGRAMMER.3 83.82,1.27 52.07,1.27 PD0-7.1
PA0
  Top 0.254: U1.37 63.39,33.45 62.23,34.61 62.23,41.91 PA0-7.1
  Top 0.406: R9.2 59.17,53.73 IC1.4
  Bottom 0.254: IC1.4 59.17,46.47 PA0-7.1
PA1
  Top 0.254: U1.36 63.99,34.12 62.87,35.24 62.87,43.81 PA0-7.2
PA2
  Top 0.254: U1.35 64.48,34.58 63.5,35.56 PA0-7.3
PA3
  Top 0.254: U1.34 65.12,44.8 PA0-7.4
PA4
  Top 0.254: U1.33 67.6,44.74 PA0-7.5
PA7
  Top 0.254: U1.30 69.33,33.45 70.48,34.61 70.48,40.01 PA0-7.8 81.65,45.72 R5.1
  Top 0.305: R5.1 R4.2
PB0
  Top 0.254: U1.40 61.59,31.76 60.33,33.02 55.88,33.02 PB0-7.1
  Bottom 0.305: PB0-7.1 44.6,40.64 U$11.P$2
PB2  (via drill 0.6)
  Top 0.254: U1.42 60.49,30.63 59.37,31.75 52.07,31.75 PB0-7.3
  Top 0.305: PB0-7.3 v38.1,35.56
  Bottom 0.305: v38.1,35.56 33.66,35.56 U$5.ENABLE
PB3  (via drill 0.6)
  Top 0.254: U1.43 60.03,30.14 59.37,30.8 50.48,30.8 PB0-7.4 | U$2.A0/!CS 33.3,11.79 v33.34,11.75
  Top 0.305: v42.27,28.75 42.27,29.94 45.31,32.99 48.23,32.99 PB0-7.4
  Bottom 0.254: 42.23,21.91 40.01,19.68 36.83,19.68 33.97,16.83 33.97,12.38 v33.34,11.75
  Bottom 0.305: 42.23,21.91 42.23,28.71 v42.27,28.75
PB5/MOSI  (via drill 0.6)
  Top 0.254: IC3.B6 44.74,24.43 PB0-7.6 49.18,27.02 U1.1 | 59.48,27.09 59.61,27.09 60.96,28.45 v61.47,28.45 | v73.66,48.77 75.95,51.05 75.95,52.58 73.15,55.37 73.15,57.4 U$7.A1/SI
  Top 0.305: U1.1 59.48,27.09
  Bottom 0.254: v61.47,28.45 61.47,36.07 69.85,44.45 69.85,46.99 71.25,48.39 73.28,48.39 v73.66,48.77
PB6/MISO  (via drill 0.6)
  Top 0.254: IC3.B7 46.63,23.77 PB0-7.7 49.02,26.16 58.55,26.16 58.8,25.91 59.31,25.91 59.86,26.46 U1.2 60.03,26.51 60.96,27.43 62.48,27.43 v62.87,27.81 | v75.06,48.26 76.71,49.91 76.71,52.58 73.79,55.5 U$7.-/SO
  Bottom 0.254: v62.87,27.81 62.87,34.92 72.39,44.45 72.39,46.99 73.03,47.62 74.42,47.62 v75.06,48.26
PB7/SCLK  (via drill 0.6)
  Top 0.254: IC3.B8 47.99,23.12 PB0-7.8 50.42,25.02 56.52,25.02 57.15,25.65 58.17,25.65 58.55,25.27 60.07,25.27 60.61,25.81 U1.3 60.61,25.94 61.47,26.8 63.88,26.8 v64.39,27.3 | v76.2,48.26 77.47,49.53 77.47,52.58 74.42,55.63 74.42,57.39 U$7.SCL/SCLK
  Bottom 0.254: v64.39,27.3 64.39,33.91 74.93,44.45 74.93,46.99 v76.2,48.26
PC0
  Top 0.254: U1.19 71.57,25.33 72.26,24.64 73.91,24.64 74.04,24.51 74.04,22.86 74.8,22.1 74.8,20.45 PC0-7.1
PC1
  Top 0.254: U1.20 72.16,25.89 72.77,25.27 74.17,25.27 74.68,24.77 74.68,23.11 PC0-7.2
PC2
  Top 0.254: U1.21 72.73,26.46 73.41,25.78 74.55,25.78 PC0-7.3
PC3
  Top 0.254: U1.22 75.85,27.02 PC0-7.4
PC4
  Top 0.254: U1.23 75.91,29.5 PC0-7.5
PC5
  Top 0.254: U1.24 72.68,30.14 73.66,31.11 75.56,31.11 PC0-7.6
PC6
  Top 0.254: U1.25 72.22,30.63 73.34,31.75 73.66,31.75 PC0-7.7
  Bottom 0.305: U$4.OFF 90.17,22.86 80.01,22.86 78.74,24.13 78.74,31.75 PC0-7.7
PC7  (via drill 0.6)
  Top 0.254: U1.26 71.55,31.23 72.71,32.38 72.71,33.34 PC0-7.8 | U$7.A0/!CS 72.49,59.66 72.64,59.82 75.06,59.82 75.18,59.69 75.18,55.75 78.36,52.58 78.36,46.23 81.79,46.23 82.3,45.72 85.72,45.72 v87.25,44.2
  Bottom 0.254: v87.25,44.2 87.25,42.16 87,41.91 81.28,41.91 PC0-7.8
PD1/TXD0
  Top 0.254: U1.10 64.56,21.89 63.37,20.7 63.37,15.24 60.2,12.06 57.78,12.06 PD0-7.2
  Top 0.305: PROGRAMMER.2 82.55,2.54 53.34,2.54 PD0-7.2
PD2/RXD1
  Top 0.254: U1.11 65.07,21.38 64.14,20.45 64.14,14.73 56.39,6.99 55.24,6.99 PD0-7.3
PD3/TXD1
  Top 0.254: U1.12 67.6,20.61 64.77,17.78 64.77,13.97 PD0-7.4
PD4
  Top 0.254: U1.13 68.15,21.89 68.96,21.08 68.96,20.95 65.53,17.53 65.53,13.46 58.42,6.35 PD0-7.5
PD5
  Top 0.254: U1.14 68.73,22.46 69.6,21.59 69.6,20.7 66.29,17.4 66.29,13.21 60.96,7.87 PD0-7.6
PD6
  Top 0.254: U1.15 69.28,23.04 70.1,22.23 70.1,20.32 67.06,17.27 67.06,12.83 63.5,9.27 PD0-7.7
PD7
  Top 0.254: U1.16 69.96,23.64 70.87,22.73 70.87,19.94 67.94,17.02 67.94,13.72 | 67.94,13.72 67.94,6.99 PD0-7.8 | R6.1 68.06,13.6 67.94,13.72
POWERON
  Top 0.406: U$4.ON ON/12V-OUT.P$1
SKCK3V3
  Top 0.305: IC3.A8 30.23,23.11 32.77,20.57 32.77,14.48 32.02,13.73 U$2.SCL/SCLK 26.91,13.73 26.42,14.22 26.42,16.13 25.27,17.27 17.02,17.27 11.05,11.3 8.51,11.3 U$1.SCLK

### Text on the board
tPlace: GND | 3V3 | 5V | PA | PB | suzibot / 1.5 | MOSI | MISO | SCK | SDA | SCL | PC | PD | PROG | RX0 | TX0 | RX1 | TX1 | DTR | RXI | TXO | VCC | CTS | GND
bPlace: 6 November 2016 | 5V | @coddingtonbear | GND | L | K | 12VIN | GND | VOUT | ON
tOrigins: ON